# Altium schematic sheet i2c_devices.SchDoc
size A4; SheetNumber: 4; SheetTotal: 7; NameOfSheet: OLED display
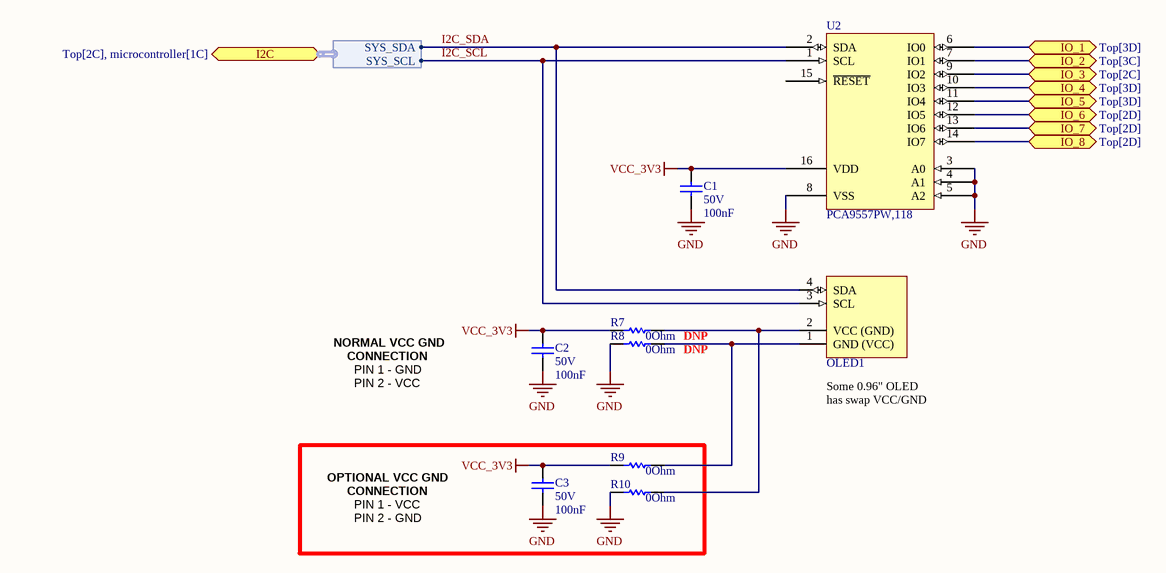
[diagram p0: i2c_devices.SchDoc]

## Parts
C1  Voltage: 50V  Capacitance: 100nF  [CAP_0603_High_density]
C2  Voltage: 50V  Capacitance: 100nF  [CAP_0603_High_density]
C3  Voltage: 50V  Capacitance: 100nF  [CAP_0603_High_density]
OLED1  MDOB128064WV-YBI  [OLED_I2C]  (value not drawn)
R7  Resistance: 0Ohm  [RES_0603]  (hidden comment: RES_0_0402_1_1/16)  (no BOM)
R8  Resistance: 0Ohm  [RES_0603]  (hidden comment: RES_0_0402_1_1/16)  (no BOM)
R9  Resistance: 0Ohm  [RES_0603]  (hidden comment: RES_0_0402_1_1/16)
R10  Resistance: 0Ohm  [RES_0603]  (hidden comment: RES_0_0402_1_1/16)
U2  PCA9557PW,118  [TSOP65P640X120-16M]

## Ports
I2C (bidir, harness I2C_SYS2, see Top[2C], microcontroller[1C]), IO_1 (bidir, see Top[3D]), IO_2 (bidir, see Top[3C]), IO_3 (bidir, see Top[2C]), IO_4 (bidir, see Top[3D]), IO_5 (bidir, see Top[3D]), IO_6 (bidir, see Top[2D]), IO_7 (bidir, see Top[2D]), IO_8 (bidir, see Top[2D])

## Harnesses
I2C_SYS2: SYS_SCL, SYS_SDA

## Nets
GND: C1.2 C2.2 C3.2 R8.2 R10.2 U2.3(A0) U2.4(A1) U2.5(A2) U2.8(VSS)
VCC_3V3: C1.1 C2.1 C3.1 R7.2 R9.2 U2.16(VDD)
I2C_SCL: OLED1.3(SCL) U2.1(SCL) ; port I2C.SYS_SCL
I2C_SDA: OLED1.4(SDA) U2.2(SDA) ; port I2C.SYS_SDA
IO_1: U2.6(IO0) ; port IO_1
IO_2: U2.7(IO1) ; port IO_2
IO_3: U2.9(IO2) ; port IO_3
IO_4: U2.10(IO3) ; port IO_4
IO_5: U2.11(IO4) ; port IO_5
IO_6: U2.12(IO5) ; port IO_6
IO_7: U2.13(IO6) ; port IO_7
IO_8: U2.14(IO7) ; port IO_8
NetOLED1_1: OLED1.1(GND_(VCC)) R8.1 R9.1
NetOLED1_2: OLED1.2(VCC_(GND)) R7.1 R10.1

Not connected (* = marked no-connect by the designer): U2 15(~{RESET})

## Notes on the sheet
- NORMAL VCC GND
- CONNECTION
- DNP
- PIN 1 - GND
- PIN 2 - VCC
- (near OLED1) Some 0.96" OLED has swap VCC/GND
- OPTIONAL VCC GND
- PIN 1 - VCC
- PIN 2 - GND
- Author:
- Sheet:
- /
- Issue date:
- Project name:
- Revision:
- Date:
- Page name:

## Library data of the parts
C1-C3 = Capacitor SMD: Generic Ceramic Capacitor SMD; Temperature Coefficient: X7R; Tolerance: 10%; Package: 0603; Supplier 1: LCSC; Supplier Part Number 1: C282519
OLED1 = OLED_I2C: Graphic OLED, 128 x 64 Pixels, Yellow on Black, 3.3V, I2C, 27.30mm x 27.30mm x 2.72mm panel size; Supplier 1: Farnell; Supplier Part Number 1: 3565084; ClassName: DISPLAYS
R7-R10 = Resistor SMD: Generic Resistor SMD; Manufacturer Part Number: RES_0_0402_1_1/16; Supplier 1: LCSC; Supplier Part Number 1: C21189
U2 = PCA9557PW,118: 8-bit I2C-bus and SMBus I/O port with reset; Supplier 1: LCSC; Supplier Part Number 1: C141380